# Altium schematic sheet Main.SchDoc
size B; SheetNumber: 1; SheetTotal: 4
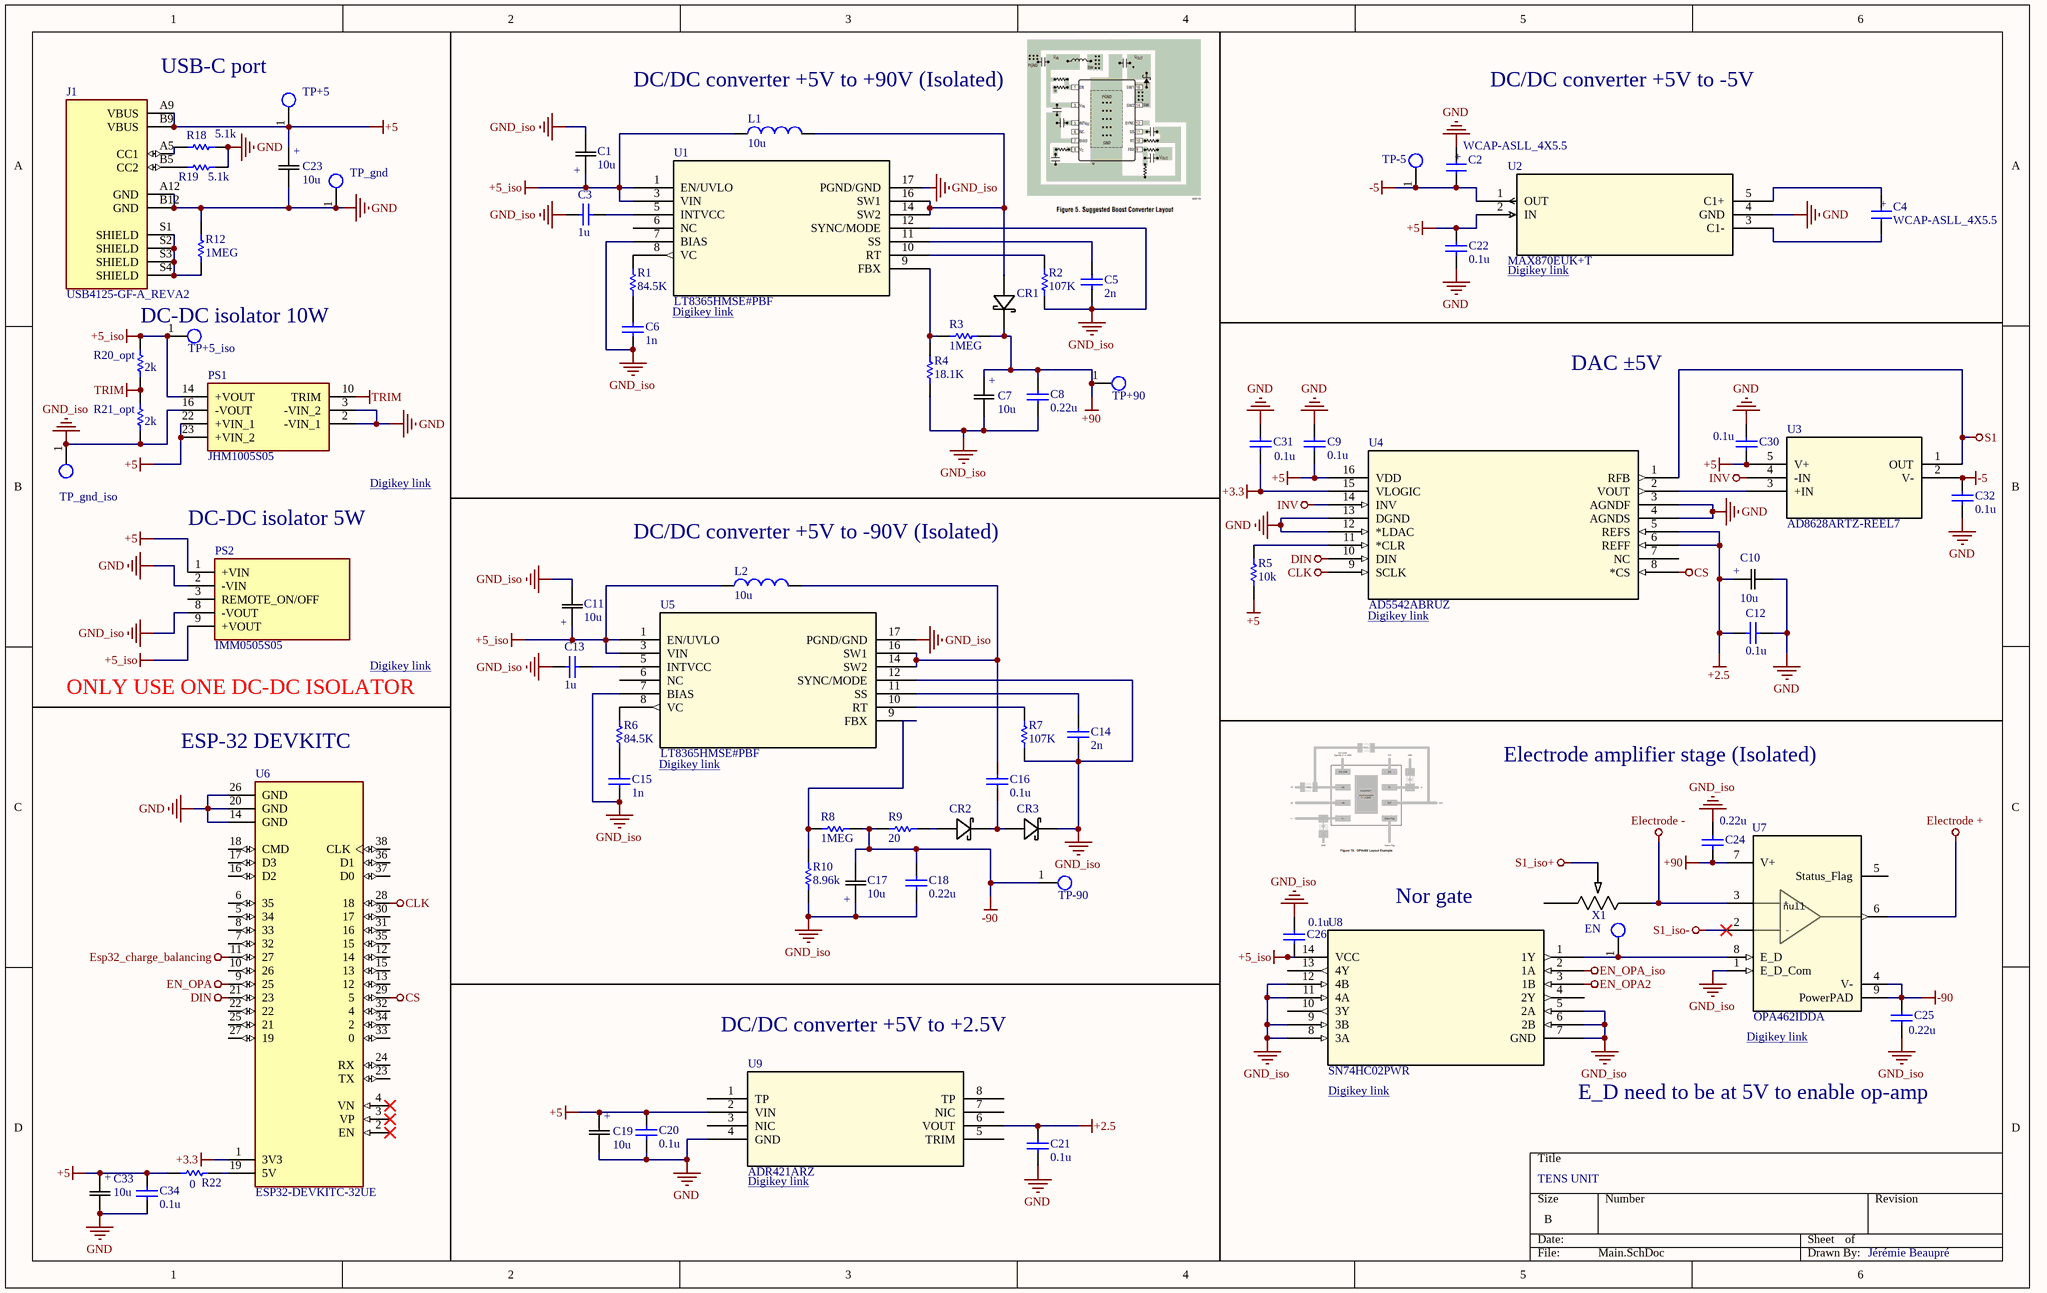
[diagram p0: Main.SchDoc]

## Parts
C1  10u  [CAP_BX_10x20_RUB]
C2  WCAP-ASLL_4X5.5  [WCAP-ASLL_4X5.5(DXL)]
C3  value 1u  [0805_AVX]  (hidden comment: Capacitor)
C4  WCAP-ASLL_4X5.5  [WCAP-ASLL_4X5.5(DXL)]
C5  value 2n  [CAPC2012X75N]  (hidden comment: Capacitor)
C6  value 1n  [CC0805N_YAG]  (hidden comment: Capacitor)
C7  10u  [CAP_BX_10x20_RUB]
C8  value 0.22u  [CAP_C3225X7R2E224K200AA]  (hidden comment: Capacitor)
C9  value 0.1u  [CAPC2012X150N]  (hidden comment: Capacitor)
C10  10u  [CAP_BX_10x20_RUB]
C11  10u  [CAP_BX_10x20_RUB]
C12  value 0.1u  [CAPC2012X150N]  (hidden comment: Capacitor)
C13  value 1u  [0805_AVX]  (hidden comment: Capacitor)
C14  value 2n  [CAPC2012X75N]  (hidden comment: Capacitor)
C15  value 1n  [CC0805N_YAG]  (hidden comment: Capacitor)
C16  value 0.1u  [CAPC2012X150N]  (hidden comment: Capacitor)
C17  10u  [CAP_BX_10x20_RUB]
C18  value 0.22u  [CAP_C3225X7R2E224K200AA]  (hidden comment: Capacitor)
C19  10u  [CAP_BX_10x20_RUB]
C20  value 0.1u  [CAPC2012X150N]  (hidden comment: Capacitor)
C21  value 0.1u  [CAPC2012X150N]  (hidden comment: Capacitor)
C22  value 0.1u  [CAPC2012X150N]  (hidden comment: Capacitor)
C23  10u  [CAP_BX_10x20_RUB]
C24  value 0.22u  [CAP_C3225X7R2E224K200AA]  (hidden comment: Capacitor)
C25  value 0.22u  [CAP_C3225X7R2E224K200AA]  (hidden comment: Capacitor)
C26  value 0.1u  [CAPC2012X150N]  (hidden comment: Capacitor)
C30  value 0.1u  [CAPC2012X150N]  (hidden comment: Capacitor)
C31  value 0.1u  [CAPC2012X150N]  (hidden comment: Capacitor)
C32  value 0.1u  [CAPC2012X150N]  (hidden comment: Capacitor)
C33  10u  [CAP_BX_10x20_RUB]
C34  value 0.1u  [CAPC2012X150N]  (hidden comment: Capacitor)
CR1  SK220ATR  [DIODE_SK220ATR_SMC-M]  (value not drawn)
CR2  SK220ATR  [DIODE_SK220ATR_SMC-M]  (value not drawn)
CR3  SK220ATR  [DIODE_SK220ATR_SMC-M]  (value not drawn)
EN  Testpoint_1  [Testpoint1]  (value not drawn)  (no BOM)
J1  USB4125-GF-A_REVA2  [GCT_USB4125-GF-A_REVA2]
L1  value 10u  [DR73]  (hidden comment: Inductor)
L2  value 10u  [DR73]  (hidden comment: Inductor)
PS1  JHM1005S05  [JHM1005S05]
PS2  IMM0505S05  [IMM0505S05]
R1  value 84.5K  [Resistor_0805-M]  (hidden comment: Resistor)
R2  value 107K  [Resistor_0805-M]  (hidden comment: Resistor)
R3  value 1MEG  [Resistor_0805-M]  (hidden comment: Resistor)
R4  value 18.1K  [Resistor_0805-M]  (hidden comment: Resistor)
R5  value 10k  [Resistor_0805-M]  (hidden comment: Resistor)
R6  value 84.5K  [Resistor_0805-M]  (hidden comment: Resistor)
R7  value 107K  [Resistor_0805-M]  (hidden comment: Resistor)
R8  1MEG  [Resistor_0805-M]
R9  value 20  [Resistor_0805-M]  (hidden comment: Resistor)
R10  value 8.96k  [Resistor_0805-M]  (hidden comment: Resistor)
R12  value 1MEG  [Resistor_0805-M]  (hidden comment: Resistor)
R18  value 5.1k  [Resistor_0805-M]  (hidden comment: Resistor)
R19  value 5.1k  [Resistor_0805-M]  (hidden comment: Resistor)
R20_opt  value 2k  [Resistor_0805-M]  (hidden comment: Resistor)
R21_opt  value 2k  [Resistor_0805-M]  (hidden comment: Resistor)
R22  value 0  [Resistor_0805-M]  (hidden comment: Resistor)
TP+5  Testpoint_1  [Testpoint1]  (value not drawn)  (no BOM)
TP+5_iso  Testpoint_1  [Testpoint1]  (value not drawn)  (no BOM)
TP+90  Testpoint_1  [Testpoint1]  (value not drawn)  (no BOM)
TP-5  Testpoint_1  [Testpoint1]  (value not drawn)  (no BOM)
TP-90  Testpoint_1  [Testpoint1]  (value not drawn)  (no BOM)
TP_gnd  Testpoint_1  [Testpoint1]  (value not drawn)  (no BOM)
TP_gnd_iso  Testpoint_1  [Testpoint1]  (value not drawn)  (no BOM)
U1  LT8365HMSE#PBF  [05-08-1871_ADI]
U2  MAX870EUK+T  [21-0057F_MXM]
U3  AD8628ARTZ-REEL7  [RJ_5_ADI]
U4  AD5542ABRUZ  [RU_16_ADI]
U5  LT8365HMSE#PBF  [05-08-1871_ADI]
U6  ESP32-DEVKITC-32UE  [ESPRESSIF_ESP32-DEVKITC-32UE]
U7  OPA462IDDA  [DDA0008J-IPC_A]
U8  SN74HC02PWR  [PW14]
U9  ADR421ARZ  [R_8_ADI]
X1  PV36W102C01B00  [POT_PV36W_MUR]  (value not drawn)

## Nets
+2.5: C10.1(+) C12.2 C21.2 U4.5(REFS) U4.6(REFF) U9.6(VOUT)
+3.3: C31.2 U4.15(VLOGIC) U6.1(3V3)
+5: C9.2 C19.1(+) C20.2 C22.1 C23.1(+) C30.2 C33.1(+) C34.2 J1.A9(VBUS) J1.B9(VBUS) PS1.22(+VIN_1) PS1.23(+VIN_2) PS2.1(+VIN) R5.1 R22.2 TP+5.1(P1) U2.2(IN) U3.5(V+) U4.16(VDD) U9.2(VIN)
+5_iso: C1.1(+) C11.1(+) C26.1 L1.1 L2.1 PS1.14(+VOUT) PS2.9(+VOUT) R20_opt.1 TP+5_iso.1(P1) U1.1(EN/UVLO) U1.3(VIN) U5.1(EN/UVLO) U5.3(VIN) U8.14(VCC)
+90: C7.1(+) C8.2 C24.2 CR1.1 R3.2 TP+90.1(P1) U7.7(V+)
-5: C2.2(NEG) C32.2 TP-5.1(P1) U2.1(OUT) U3.2(V-)
-90: C17.2 C18.2 C25.1 R8.1 R9.2 TP-90.1(P1) U7.4(V-) U7.9(PowerPAD)
CLK: U4.9(SCLK) U6.28(18)
CS: U4.8(*CS) U6.29(5)
DIN: U4.10(DIN) U6.21(23)
Electrode +: U7.6(OUT)
Electrode -: U7.3(+IN) X1.3
EN_OPA: U6.9(25)
EN_OPA2: U8.3(1B)
EN_OPA_iso: U8.2(1A)
Esp32_charge_balancing: U6.11(27)
GND: C2.1(POS) C9.1 C10.2 C12.1 C19.2 C20.1 C21.1 C22.2 C23.2 C30.1 C31.1 C32.1 C33.2 C34.1 J1.A12(GND) J1.B12(GND) PS1.2(-VIN_1) PS1.3(-VIN_2) PS2.2(-VIN) R12.2 R18.1 R19.1 TP_gnd.1(P1) U2.4(GND) U4.3(AGNDF) U4.4(AGNDS) U4.12(*LDAC) U4.13(DGND) U6.14(GND) U6.20(GND) U6.26(GND) U9.4(GND)
GND_iso: C1.2 C3.2 C5.1 C6.1 C7.2 C8.1 C11.2 C13.2 C14.1 C15.1 C17.1(+) C18.1 C24.1 C25.2 C26.2 CR3.1 PS1.16(-VOUT) PS2.8(-VOUT) R2.1 R4.2 R7.1 R10.2 R21_opt.2 TP_gnd_iso.1(P1) U1.7(BIAS) U1.12(SYNC/MODE) U1.17(PGND/GND) U5.7(BIAS) U5.12(SYNC/MODE) U5.17(PGND/GND) U7.1(E_D_Com) U8.5(2A) U8.6(2B) U8.7(GND) U8.8(3A) U8.9(3B) U8.11(4A) U8.12(4B)
INV: U3.4(-IN) U4.14(INV)
S1: U3.1(OUT) U4.1(RFB)
S1_iso+: X1.2
S1_iso-: U7.2(-IN)
TRIM: PS1.10(TRIM) R20_opt.2 R21_opt.1
NetC3_1: C3.1 U1.5(INTVCC)
NetC4_1: C4.1(POS) U2.5(C1+)
NetC4_2: C4.2(NEG) U2.3(C1-)
NetC5_2: C5.2 U1.11(SS)
NetC6_2: C6.2 R1.1
NetC13_1: C13.1 U5.5(INTVCC)
NetC14_2: C14.2 U5.11(SS)
NetC15_2: C15.2 R6.1
NetC16_1: C16.1 CR2.1 CR3.2
NetC16_2: C16.2 L2.2 U5.14(SW2) U5.16(SW1)
NetCR1_2: CR1.2 L1.2 U1.14(SW2) U1.16(SW1)
NetCR2_2: CR2.2 R9.1
NetEN_1: EN.1(P1) U7.8(E_D) U8.1(1Y)
NetJ1_A5: J1.A5(CC1) R18.2
NetJ1_B5: J1.B5(CC2) R19.2
NetJ1_S1: J1.S1(SHIELD) J1.S2(SHIELD) J1.S3(SHIELD) J1.S4(SHIELD) R12.1
NetR1_2: R1.2 U1.8(VC)
NetR2_2: R2.2 U1.10(RT)
NetR3_1: R3.1 R4.1 U1.9(FBX)
NetR5_2: R5.2 U4.11(*CLR)
NetR6_2: R6.2 U5.8(VC)
NetR7_2: R7.2 U5.10(RT)
NetR8_2: R8.2 R10.1 U5.9(FBX)
NetR22_1: R22.1 U6.19(5V)
NetU3_3: U3.3(+IN) U4.2(VOUT)

Not connected (* = marked no-connect by the designer): PS2 3(REMOTE_ON/OFF); U1 6(NC); U4 7(NC); U5 6(NC); U6 2(EN)* 3(VP)* 4(VN)* 5(34) 6(35) 7(32) 8(33) 10(26) 12(14) 13(12) 15(13) 16(D2) 17(D3) 18(CMD) 22 23(TX) 24(RX) 25(21) 27(19) 30(17) 31(16) 32(4) 33(0) 34(2) 35(15) 36(D1) 37(D0) 38(CLK); U7 5(Status_Flag); U8 4(2Y) 10(3Y) 13(4Y); U9 1(TP) 3(NIC) 5(TRIM) 7(NIC) 8(TP); X1 1

## Notes on the sheet
- USB-C port
- (near L1) DC/DC converter +5V to +90V (Isolated)
- DC/DC converter +5V to -5V
- Digikey link <https://www.digikey.ca/en/products/detail/analog-devices-inc-maxim-integrated/MAX870EUK-T/1519059?_gl=1*bc40r*_up*MQ..*_gs*MQ..&gclid=Cj0KCQjwm8bTBhDWARIsAC9Hi8lZmiOB0El9-E_6c1ow4nDcjeTHfbqA0Lnjgy8U8yTUWBJwg5PWeQ0aAiB7EALw_wcB&gclsrc=aw.ds&gbraid=0AAAAADrbLlh2Yqokbm2Ifr7gOHjBvqx8v>
- (near TP+5_iso) DC-DC isolator 10W
- Digikey link <https://www.digikey.ca/en/products/detail/analog-devices-inc/LT8365HMSE-PBF/11586882?_gl=1*1sgahmh*_up*MQ..*_gs*MQ..&gclid=Cj0KCQjwm8bTBhDWARIsAC9Hi8lZmiOB0El9-E_6c1ow4nDcjeTHfbqA0Lnjgy8U8yTUWBJwg5PWeQ0aAiB7EALw_wcB&gclsrc=aw.ds&gbraid=0AAAAADrbLlh2Yqokbm2Ifr7gOHjBvqx8v>
- DAC ±5V
- Digikey link <https://www.digikey.ca/en/products/detail/xp-power/JHM1005S05/4488429?s=N4IgTCBcDaIFYAsC2BGADGgrAZyyAugL5A>
- (near PS2) DC-DC isolator 5W
- (near L2) DC/DC converter +5V to -90V (Isolated)
- (near U4) Digikey link <https://www.digikey.ca/en/products/detail/analog-devices-inc/AD5542ABRUZ/2506909?_gl=1*iimu8l*_up*MQ..*_gs*MQ..&gclid=Cj0KCQjwm8bTBhDWARIsAC9Hi8lZmiOB0El9-E_6c1ow4nDcjeTHfbqA0Lnjgy8U8yTUWBJwg5PWeQ0aAiB7EALw_wcB&gclsrc=aw.ds&gbraid=0AAAAADrbLlh2Yqokbm2Ifr7gOHjBvqx8v>
- (near PS2) ONLY USE ONE DC-DC ISOLATOR
- Digikey link <https://www.digikey.ca/en/products/detail/xp-power/IMM0505S05/9843481>
- (near U6) ESP-32 DEVKITC
- Electrode amplifier stage (Isolated)
- Nor gate
- DC/DC converter +5V to +2.5V
- (near U7) Digikey link <https://www.digikey.ca/en/products/detail/texas-instruments/OPA462IDDA/11502197?_gl=1*15g1sy5*_up*MQ..*_gs*MQ..&gclid=Cj0KCQjwm8bTBhDWARIsAC9Hi8lZmiOB0El9-E_6c1ow4nDcjeTHfbqA0Lnjgy8U8yTUWBJwg5PWeQ0aAiB7EALw_wcB&gclsrc=aw.ds&gbraid=0AAAAADrbLlh2Yqokbm2Ifr7gOHjBvqx8v>
- (near U8) Digikey link <https://www.digikey.ca/en/products/detail/texas-instruments/SN74HC02PWR/377046?_gl=1*15g1sy5*_up*MQ..*_gs*MQ..&gclid=Cj0KCQjwm8bTBhDWARIsAC9Hi8lZmiOB0El9-E_6c1ow4nDcjeTHfbqA0Lnjgy8U8yTUWBJwg5PWeQ0aAiB7EALw_wcB&gclsrc=aw.ds&gbraid=0AAAAADrbLlh2Yqokbm2Ifr7gOHjBvqx8v>
- E_D need to be at 5V to enable op-amp
- TENS UNIT
- (near U9) Digikey link <https://www.digikey.ca/en/products/detail/analog-devices-inc/ADR421ARZ/936588?_gl=1*1nl2uwz*_up*MQ..*_gs*MQ..&gclid=Cj0KCQjwm8bTBhDWARIsAC9Hi8lZmiOB0El9-E_6c1ow4nDcjeTHfbqA0Lnjgy8U8yTUWBJwg5PWeQ0aAiB7EALw_wcB&gclsrc=aw.ds&gbraid=0AAAAADrbLlh2Yqokbm2Ifr7gOHjBvqx8v>
- Jérémie Beaupré
- (in symbol OPA462IDDA) +; null; -
- (in symbol WCAP-ASLL_4X5.5) +

## Library data of the parts
C1 C7 C10 C11 C17 C19 C23 C33 = 450BXC10MEFC10X20: No Description Available; Manufacturer_Name: Rubycon; Copyright: Copyright (C) 2026 Ultra Librarian. All rights reserved.; Manufacturer_Part_Number: 450BXC10MEFC10X20
C2 C4 = WCAP-ASLL_4X5.5: MF: {'manufacturer': u'W\xfcrth Elektronik'}; MP: 865060640001; Package: None; Price: None; Value: *; Availability: Unavailable
C3 C5 C6 C8 C9 C12-C16 C18 C20-C22 C24-C26 C30-C32 C34 = Capacitor: SimulationGenericComponent: True
CR1-CR3 = SK220ATR: No Description Available; Manufacturer_Name: SMC Diode Solutions; Copyright: Copyright (C) 2026 Ultra Librarian. All rights reserved.; Manufacturer_Part_Number: SK220ATR
L1 L2 = Inductor: SimulationGenericComponent: True
PS1 = JHM1005S05: Power Supply; Manufacturer_Name: XP POWER; Datasheet Link: https://docs.rs-online.com/50a4/0900766b8150c28f.pdf; Height: 13.2mm; Manufacturer_Part_Number: JHM1005S05; Mouser Part Number: 209-JHM1005S05; Mouser Price/Stock: https://www.mouser.co.uk/ProductDetail/XP-Power/JHM1005S05?qs=w%2Fv1CP2dgqr7tGfLUXFVVQ%3D%3D
PS2 = IMM0505S05: Power Supply; Manufacturer_Name: XP POWER; Datasheet Link: https://www.xppower.com/portals/0/pdfs/SF_IMM05.pdf; Height: 13mm; Manufacturer_Part_Number: IMM0505S05; Mouser Part Number: 209-IMM0505S05; Mouser Price/Stock: https://www.mouser.co.uk/ProductDetail/XP-Power/IMM0505S05?qs=0lSvoLzn4L%2FxNlweCwWKNw%3D%3D
R1-R10 R12 R18 R19 R20_opt R21_opt = Resistor: TC1: 0; SimulationGenericComponent: True; TC2: 0
  R8: Value: 1MEG
R22 = Resistor: SimulationGenericComponent: True; TC1: 0; TC2: 0
U1 U5 = LT8365HMSEPBF: Low IQ Boost/SEPIC/Inverting Converter with 1.5A, 150V SwitchÂ; Manufacturer_Name: Analog Devices Inc; Type: Power Management; Copyright: Copyright (C) 2025 Ultra Librarian. All rights reserved.; Manufacturer_Part_Number: LT8365HMSE#PBF; RefDes: RefDes
U2 = MAX870EUK+T: Switched-Capacitor Voltage Inverters; Manufacturer_Name: Analog Devices Inc; Copyright: Copyright (C) 2026 Ultra Librarian. All rights reserved.; Manufacturer_Part_Number: MAX870EUK+T; RefDes: RefDes; Type: Type
U3 = AD8628ARTZ-REEL7: Zero-Drift, Single-Supply, Rail-to-Rail Input/Output Operational Amplifier; Manufacturer_Name: Analog Devices Inc; Copyright: Copyright (C) 2025 Ultra Librarian. All rights reserved.; Manufacturer_Part_Number: AD8628ARTZ-REEL7; RefDes: RefDes; Type: Type
U4 = AD5542ABRUZ: 2.7 V to 5.5 V, Serial-Input, Voltage-Output, 16-Bit nanoDACâ„¢ in 10-lead LFCSP, 16-lead 3 mm x 3 mm LFCSP, and 16-lead TSSOP; Manufacturer_Name: Analog Devices Inc; Copyright: Copyright (C) 2026 Ultra Librarian. All rights reserved.; Manufacturer_Part_Number: AD5542ABRUZ; RefDes: RefDes; Type: Type
U6 = ESP32-DEVKITC-32UE: The ESP32-DEVKITC-32UE evaluation board from Espressif Systems is designed for seamless wireless connectivity in IoT applications. Powered by the ESP32-WROOM-32UE module, it supports dual-mode BluetoothÂ® Smart Ready 4.x and 802.11 b/g/n Wi-Fi at 2.4GHz.; SnapEDA_Link: https://www.snapeda.com/parts/ESP32-DEVKITC-32UE/Espressif+Systems/view-part/?ref=snap; Package: CUSTOM-38 ESPRESSIF; Value: *; MF: Espressif Systems; MP: ESP32-DEVKITC-32UE; Check_prices: https://www.snapeda.com/parts/ESP32-DEVKITC-32UE/Espressif+Systems/view-part/?ref=eda
U7 = OPA462IDDA: 180-V, wide bandwidth (6.5 MHz), high-slew rate (25 V/Âµs) unity-gain stable op amp 8-SO PowerPAD -40 to 85; Manufacturer_Name: Texas Instruments; TYPE: TYPE; RefDes: RefDes; Copyright: Copyright (C) 2026 Ultra Librarian. All rights reserved.; Manufacturer_Part_Number: OPA462IDDA
U8 = SN74HC02PWR: 4-ch, 2-input, 2-V to 6-V 5.2 mA drive strength NOR gate 14-TSSOP -40 to 85; Manufacturer_Name: Texas Instruments; Copyright: Copyright (C) 2026 Ultra Librarian. All rights reserved.; Manufacturer_Part_Number: SN74HC02PWR; RefDes: RefDes; Type: Type
U9 = ADR421ARZ: Ultraprecision, Low Noise, 2.500 V XFETÂ® Voltage References; Manufacturer_Name: Analog Devices Inc; Copyright: Copyright (C) 2026 Ultra Librarian. All rights reserved.; Manufacturer_Part_Number: ADR421ARZ; RefDes: RefDes; Type: Type
X1 = PV36W102C01B00: No Description Available; Manufacturer_Name: Murata; Copyright: Copyright (C) 2026 Ultra Librarian. All rights reserved.; Manufacturer_Part_Number: PV36W102C01B00
J1 = USB4125-GF-A_REVA2: Package: None; Availability: Unavailable; MP: USB4125-GF-A_REVA2; Value: *; Price: None